# Altium project BMS_rev3.PrjPCB (part 3 of 3)

## Sheet BMS_SERIAL.SchDoc
size B; Organization: Altium Limited; Address1: L3, 12a Rodborough Rd; Address2: Frenchs Forest; Address3: NSW; Address4: Australia 2086
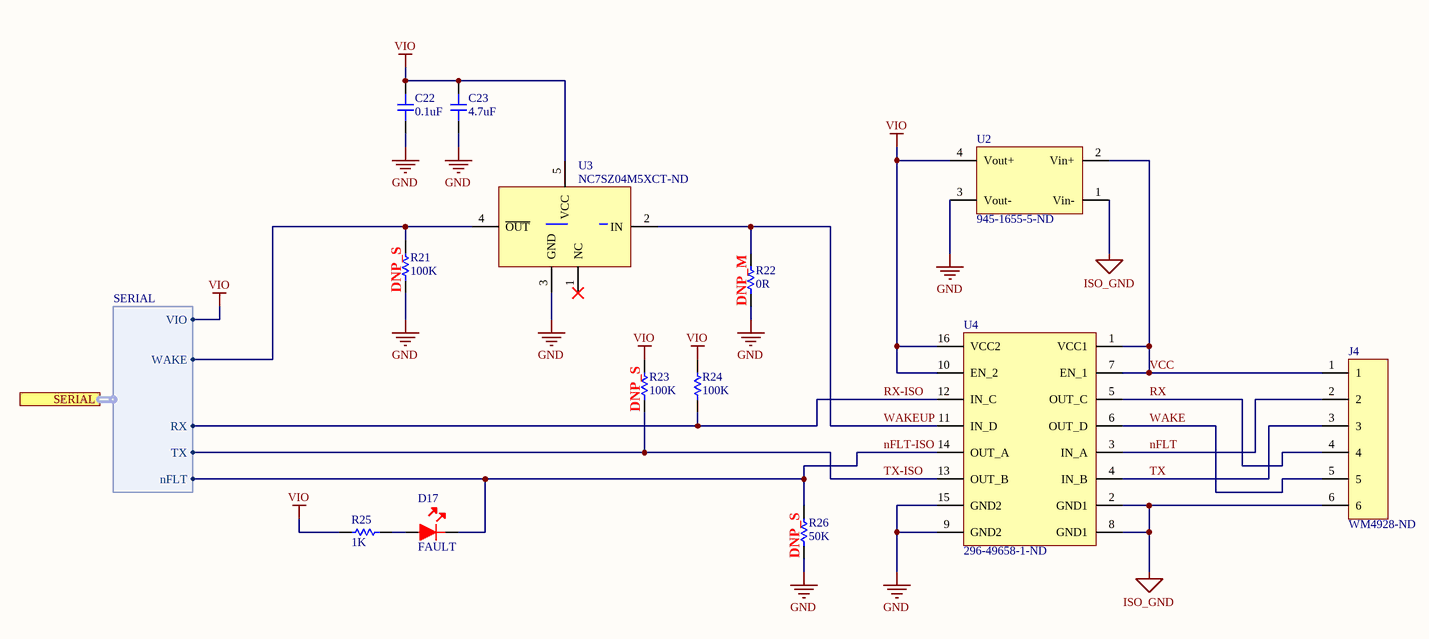
[diagram p6: BMS_SERIAL.SchDoc]

### Parts
C22  0.1uF  [CAP-0805]
C23  4.7uF  [CAP-0805]
D17  FAULT  [LED-0603]
J4  WM4928-ND  [6PIN]
R21  100K  [RES-0603]
R22  0R  [RES-0603]
R23  100K  [RES-0603]
R24  100K  [RES-0603]
R25  1K  [RES-0603]
R26  50K  [RES-0603]
U2  945-1655-5-ND  [ROE5050]
U3  NC7SZ04M5XCT-ND  [SOT-23-5]
U4  296-49658-1-ND  [16-SSOP]

### Ports
SERIAL (harness SERIAL)

### Harnesses
SERIAL: WAKE, VIO, nFLT, RX, TX

### Nets
GND: C22.1 C23.1 R21.1 R22.1 R26.1 U2.3(Vout-) U3.3(GND) U4.9(GND2) U4.15(GND2)  [project net CELL0]
ISO_GND: J4.6 U2.1(Vin-) U4.2(GND1) U4.8(GND1)
VIO: C22.2 C23.2 R23.2 R24.2 R25.2 U2.4(Vout+) U3.5(VCC) U4.10(EN_2) U4.16(VCC2) ; port SERIAL.VIO
nFLT: J4.2 U4.3(IN_A)
nFLT-ISO: D17.2 R26.2 U4.14(OUT_A) ; port SERIAL.nFLT
RX: J4.4 U4.5(OUT_C)
RX-ISO: R24.1 U4.12(IN_C) ; port SERIAL.RX
TX: J4.3 U4.4(IN_B)
TX-ISO: R23.1 U4.13(OUT_B) ; port SERIAL.TX
VCC: J4.1 U2.2(Vin+) U4.1(VCC1) U4.7(EN_1)
WAKE: J4.5 U4.6(OUT_D)
WAKE-ISO: R21.2 U3.4(~{OUT}) ; port SERIAL.WAKE
WAKEUP: R22.2 U3.2(IN) U4.11(IN_D)
NetD17_1: D17.1 R25.1

Not connected (* = marked no-connect by the designer): U3 1(NC)*

### Notes on the sheet
- (near R21) DNP_S
- (near R22) DNP_M
- (near R23) DNP_S
- (near R26) DNP_S
- Title
- Size:
- Date:
- Tabloid
- Number:
- Time:
- Revision:
- Sheet
- of
- File:

### Library data of the parts
C22 = 0805-0.1uF-50V: CAP CER 0.1UF 50V Y5V 0805; Manufacturer: KEMET; Manufacturer Part Number: C0805C104Z5VACTU; Dielectric Material: Ceramic; Capacitance: 100nF; Tolerance: 80%; Dissipation Factor: 5%; Supplier 1: Digi-Key; Stock 1: 929243; Pricing 1: 1=0.1, 10=0.057, 100=0.0254, 500=0.01818, 1000=0.01428 (USD); Mount: Surface Mount,PCB; Case/Package: 0805; Number of Pins: 2; Case Code (Metric): 2012; Case Code (Imperial): 0805; Min Operating Temperature: -30°C; Max Operating Temperature: 85°C; Package Quantity: 1; Voltage Rating: 50V; Packaging: Tape and Reel; Voltage Rating (DC): 50V; Dielectric: Y5V; Termination: SMD/SMT; Voltage: 50V; Length: 2mm; Height: 0.9mm; Lead Pitch: 0.75mm; Width: 0.049inch; Thickness: 0.039inch; Depth: 1.25mm; Radiation Hardening: No; REACH SVHC: No SVHC; Lead Free: Lead Free; ComponentLink1URL: http://www.alliedelec.com/m/d/9bfe7773041ffe9d406e68bc7b377fdd.pdf?src-supplier=Allied+Electronics; ComponentLink1Description: http://www.alliedelec.com/m/d/9bfe7773041ffe9d406e68bc7b377fdd.pdf?src-supplier=Allied+Electronics; ComponentLink2URL: https://www.verical.com/server-webapp/html/getDatasheet?partID=37101&src-supplier=Verical; ComponentLink2Description: https://www.verical.com/server-webapp/html/getDatasheet?partID=37101&src-supplier=Verical; ComponentLink3URL: https://www.verical.com/server-webapp/html/getDatasheet?partID=321176&src-supplier=Verical; ComponentLink3Description: https://www.verical.com/server-webapp/html/getDatasheet?partID=321176&src-supplier=Verical; ComponentLink4URL: http://www.farnell.com/datasheets/2123124.pdf?src-supplier=Element14; ComponentLink4Description: http://www.farnell.com/datasheets/2123124.pdf?src-supplier=Element14; Supplier Part Number 1: 399-1177-6-ND
C23 = 0805-4.7uF-16V: CAP CER 4.7UF 16V X5R 0805; Manufacturer: KEMET; Manufacturer Part Number: C0805C475K4PACTU; Dielectric Material: Ceramic; Tolerance: 10%; Supplier 1: Digi-Key; Stock 1: 96594; Pricing 1: 1=0.24, 10=0.168, 100=0.0951, 500=0.0671, 1000=0.05872 (USD); Mount: Surface Mount; Case/Package: 0805; Min Operating Temperature: -55°C; Max Operating Temperature: 85°C; Capacitance: 4.7uF; Packaging: Tape and Reel; Dielectric: X5R; Voltage: 16V; Termination: SMD/SMT; Voltage Rating (DC): 16V; Length: 2mm; Height: 1.25mm; Depth: 1.25mm; Radiation Hardening: No; Lead Free: Lead Free; ComponentLink1URL: http://capacitoredge.kemet.com/capedge2/DataSheet?pn=C0805C475K4PAC7800&src-supplier=Avnet+Europe; ComponentLink1Description: http://capacitoredge.kemet.com/capedge2/DataSheet?pn=C0805C475K4PAC7800&src-supplier=Avnet+Europe; ComponentLink2URL: https://www.verical.com/server-webapp/html/getDatasheet?partID=319476&src-supplier=Verical; ComponentLink2Description: https://www.verical.com/server-webapp/html/getDatasheet?partID=319476&src-supplier=Verical; Supplier Part Number 1: 399-8101-6-ND
D17 = LED-Red: LED RED CLEAR 0603 SMD; Manufacturer: Wurth Electronics; Manufacturer Part Number: 150060RS75000; Viewing Angle: 140°; Lens Style: Clear,Rectangular; Luminous Intensity: 250mcd; Forward Current: 30mA; Forward Voltage: 2V; Wavelength: 625nm; Test Current: 20mA; Supplier 1: Digi-Key; Stock 1: 18518; Pricing 1: 1=0.14, 50=0.133, 100=0.114, 500=0.099 (USD); Mount: Surface Mount; Case/Package: 0603; Color: Red; Case Code (Metric): 1608; Case Code (Imperial): 0603; Min Operating Temperature: -40°C; Max Operating Temperature: 85°C; Package Quantity: 1; Packaging: Cut Tape; Dominant Wavelength: 625nm; Length: 1.6mm; Height: 0.7mm; Width: 0.8mm; REACH SVHC: Unknown; ComponentLink1URL: https://katalog.we-online.de/led/datasheet/150060RS75000.pdf?src-supplier=Digi-Key; ComponentLink1Description: https://katalog.we-online.de/led/datasheet/150060RS75000.pdf?src-supplier=Digi-Key; ComponentLink2URL: http://www.produktinfo.conrad.com/datenblaetter/750000-774999/759428-da-01-en-CHIPLED_0603_W_KL_ROT_150060RS75000.pdf?src-supplier=Conrad; ComponentLink2Description: http://www.produktinfo.conrad.com/datenblaetter/750000-774999/759428-da-01-en-CHIPLED_0603_W_KL_ROT_150060RS75000.pdf?src-supplier=Conrad; Supplier Part Number 1: 732-4978-6-ND
J4 = 6PIN: CONN HEADER R/A 6POS 2.54MM; Manufacturer: Molex; Manufacturer Part Number: 70553-0040; Contact Resistance: 30mR; Number of Positions: 6; Current Rating: 3A; Voltage Rating: 250V; Gender: Male; Insulation Resistance: 1GR; Glow Wire Compliant: Non-compliant; Supplier 1: Digi-Key; Stock 1: 2212; Pricing 1: 1=1.58, 10=1.434, 100=1.2289, 500=1.0241, 1000=0.8778, 5000=0.77832, 10000=0.76076 (USD); Mount: Through Hole; Contact Material: Bronze,Copper Alloy,Brass; Contact Plating: Tin; Housing Color: Black; Color: Black; Housing Material: Thermoplastic; Material: Brass; Min Operating Temperature: -40°C; Max Operating Temperature: 105°C; Number of Rows: 1; Packaging: Rail/Tube; Termination: Solder; Number of Contacts: 6; Orientation: Right Angle; Package Quantity: 1200; Max Current Rating: 3A; Max Voltage Rating (AC): 250V; Voltage Rating (DC): 250V; Number of Circuits: 6; Length: 17.79mm; Height: 6.99mm; Pitch: 2.54mm; Depth: 13.59mm; Radiation Hardening: No; REACH SVHC: Unknown; ELV: Compliant; Lead Free: Lead Free; Flammability Rating: UL94 V-0; ComponentLink1URL: http://uk.rs-online.com/webdocs/13c4/0900766b813c4993.pdf?src-supplier=RSComponents; ComponentLink1Description: http://uk.rs-online.com/webdocs/13c4/0900766b813c4993.pdf?src-supplier=RSComponents; ComponentLink2URL: http://www.molex.com/webdocs/datasheets/pdf/en-us/0705530040_PCB_HEADERS.pdf?src-supplier=Avnet+Europe; ComponentLink2Description: http://www.molex.com/webdocs/datasheets/pdf/en-us/0705530040_PCB_HEADERS.pdf?src-supplier=Avnet+Europe; ComponentLink3URL: http://www.farnell.com/datasheets/1844551.pdf?src-supplier=Farnell; ComponentLink3Description: http://www.farnell.com/datasheets/1844551.pdf?src-supplier=Farnell; ComponentLink4URL: http://www.mouser.com/ds/2/276/0705530040_PCB_HEADERS-172948.pdf?src-supplier=Mouser; ComponentLink4Description: http://www.mouser.com/ds/2/276/0705530040_PCB_HEADERS-172948.pdf?src-supplier=Mouser; ComponentLink5URL: http://www.farnell.com/cad/655744.pdf?src-supplier=Element14; ComponentLink5Description: http://www.farnell.com/cad/655744.pdf?src-supplier=Element14; ComponentLink6URL: http://www.jameco.com/Jameco/Products/ProdDS/1302975.pdf?src-supplier=Jameco; ComponentLink6Description: http://www.jameco.com/Jameco/Products/ProdDS/1302975.pdf?src-supplier=Jameco; Supplier Part Number 1: WM4928-ND
R21 R23 R24 = 0603-100KR: RES 100K OHM 1% 1/10W 0603; Manufacturer: Stackpole Electronics; Manufacturer Part Number: RMCF0603FT100K; Resistance: 100kR; Power Rating: 100mW; Temperature Coefficient: 100ppm/°C; Working Voltage: 75V; Supplier 1: Digi-Key; Stock 1: 1428218; Pricing 1: 1=0.1, 10=0.016, 100=0.0065, 1000=0.00292, 2500=0.00253 (USD); Mount: Surface Mount; Case/Package: 0603; Case Code (Metric): 1608; Case Code (Imperial): 0603; Contact Plating: Tin,Matte; Min Operating Temperature: -55°C; Max Operating Temperature: 155°C; Packaging: Tape and Reel; Tolerance: 1%; Composition: Thick Film; Number of Terminations: 2; Military Standard: Not; Max Power Dissipation: 100mW; Features: Automotive AEC-Q200; Length: 1.55mm; Height: 0.022inch; Width: 0.031inch; Depth: 0.8mm; Radiation Hardening: No; Lead Free: Lead Free; ComponentLink1URL: https://www.verical.com/server-webapp/html/getDatasheet?partID=362597&src-supplier=Verical; ComponentLink1Description: https://www.verical.com/server-webapp/html/getDatasheet?partID=362597&src-supplier=Verical; Supplier Part Number 1: RMCF0603FT100KDKR-ND
R22 = 0603-0R: RES SMD 0 OHM JUMPER 1/10W 0603; Manufacturer: Yageo; Manufacturer Part Number: RC0603JR-070RL; Resistance: 0mR; Tolerance: 1%; Voltage Rating: 50V; Power Rating: 100mW; Temperature Coefficient: 200ppm/°C; Supplier 1: Digi-Key; Stock 1: 25658294; Pricing 1: 1=0.1, 10=0.019, 25=0.0136, 50=0.0104, 100=0.0077, 250=0.00588, 500=0.00472, 1000=0.00347 (USD); Case/Package: 0603; Number of Pins: 2; Case Code (Imperial): 0603; Case Code (Metric): 1608; Contact Plating: Tin,Matte; Min Operating Temperature: -55°C; Max Operating Temperature: 155°C; Package Quantity: 5000; Packaging: Tape and Reel; Voltage Rating (DC): 50V; Termination: SMD/SMT; Composition: Thick Film; Military Standard: Not; Length: 1.6mm; Height: 0.45mm; Width: 0.8mm; Depth: 0.8mm; Radiation Hardening: No; REACH SVHC: No SVHC; Lead Free: Lead Free; ComponentLink1URL: http://www.farnell.com/datasheets/2167052.pdf?src-supplier=Element14; ComponentLink1Description: http://www.farnell.com/datasheets/2167052.pdf?src-supplier=Element14; ComponentLink2URL: https://www.verical.com/server-webapp/html/getDatasheet?partID=329462&src-supplier=Verical; ComponentLink2Description: https://www.verical.com/server-webapp/html/getDatasheet?partID=329462&src-supplier=Verical; ComponentLink3URL: http://www.yageo.com/documents/recent/PYu-RC_Group_51_RoHS_L_9.pdf?src-supplier=Mouser; ComponentLink3Description: http://www.yageo.com/documents/recent/PYu-RC_Group_51_RoHS_L_9.pdf?src-supplier=Mouser; ComponentLink4URL: http://www.farnell.com/datasheets/443971.pdf?src-supplier=Element14; ComponentLink4Description: http://www.farnell.com/datasheets/443971.pdf?src-supplier=Element14; ComponentLink5URL: http://documents.rs-components.com/techlib://itc_doclist_GB.htm?stockno=6515918&src-supplier=RSComponents; ComponentLink5Description: http://documents.rs-components.com/techlib://itc_doclist_GB.htm?stockno=6515918&src-supplier=RSComponents; Supplier Part Number 1: 311-0.0GRCT-ND
R25 = 0603-1KR: RES SMD 1K OHM 1% 1/10W 0603; Manufacturer: Vishay Dale; Manufacturer Part Number: CRCW06031K00FKEA; Resistance: 1kR; Power Rating: 100mW; Voltage Rating: 75V; Temperature Coefficient: 100ppm/°C; Supplier 1: Digi-Key; Stock 1: 671453; Pricing 1: 1=0.1, 10=0.034, 100=0.0139, 1000=0.00623, 2500=0.0054 (USD); Mount: Surface Mount; Case/Package: 0603; Number of Pins: 2; Weight: 7.1E-05oz; Case Code (Metric): 1608; Case Code (Imperial): 0603; Contact Plating: Tin; Min Operating Temperature: -55°C; Max Operating Temperature: 155°C; Composition: Thick Film; Tolerance: 1%; Packaging: Tape and Reel; Package Quantity: 10; Number of Terminations: 2; Termination: SMD/SMT; Military Standard: Not; Max Power Dissipation: 100mW; Voltage Rating (DC): 75V; Features: Automotive AEC-Q200; Length: 1.55mm; Height: 0.45mm; Width: 0.033inch; Depth: 0.85mm; Radiation Hardening: No; REACH SVHC: Unknown; Lead Free: Lead Free; ComponentLink1URL: http://www.vishay.com/docs/20035/dcrcwe3.pdf?src-supplier=Digi-Key; ComponentLink1Description: http://www.vishay.com/docs/20035/dcrcwe3.pdf?src-supplier=Digi-Key; ComponentLink2URL: http://uk.rs-online.com/webdocs/0d98/0900766b80d98afc.pdf?src-supplier=RSComponents; ComponentLink2Description: http://uk.rs-online.com/webdocs/0d98/0900766b80d98afc.pdf?src-supplier=RSComponents; ComponentLink3URL: http://www.vishay.com/docs/20035/dcrcwe3.pdf?src-supplier=Avnet; ComponentLink3Description: http://www.vishay.com/docs/20035/dcrcwe3.pdf?src-supplier=Avnet; ComponentLink4URL: http://www.vishay.com/docs/20035/dcrcwe3.pdf?src-supplier=Avnet+Asia; ComponentLink4Description: http://www.vishay.com/docs/20035/dcrcwe3.pdf?src-supplier=Avnet+Asia; ComponentLink5URL: http://www.farnell.com/datasheets/2310790.pdf?src-supplier=Element14; ComponentLink5Description: http://www.farnell.com/datasheets/2310790.pdf?src-supplier=Element14; ComponentLink6URL: https://www.distrelec.biz/Web/Downloads/a_/en/flD-CRCW-e3_data_en.pdf?mime=application%2Fpdf&src-supplier=Distrelec; ComponentLink6Description: https://www.distrelec.biz/Web/Downloads/a_/en/flD-CRCW-e3_data_en.pdf?mime=application%2Fpdf&src-supplier=Distrelec; ComponentLink7URL: http://www.vishay.com/docs/20035/dcrcwe3.pdf?src-supplier=Future+Electronics; ComponentLink7Description: http://www.vishay.com/docs/20035/dcrcwe3.pdf?src-supplier=Future+Electronics; ComponentLink8URL: http://www.vishay.com/docs/20035/dcrcwe3.pdf?src-supplier=Avnet+Europe; ComponentLink8Description: http://www.vishay.com/docs/20035/dcrcwe3.pdf?src-supplier=Avnet+Europe; Supplier Part Number 1: 541-1.00KHCT-ND
R26 = 0603-50KR: RES SMD 49.9K OHM 1% 1/10W 0603; Manufacturer: Yageo; Manufacturer Part Number: RC0603FR-0749K9L; Power Rating: 100mW; Resistance: 49.9kR; Temperature Coefficient: 100ppm/°C; Voltage Rating (DC): 50V; Supplier 1: Digi-Key; Stock 1: 1201103; Pricing 1: 1=0.1, 10=0.023, 100=0.0094, 1000=0.00421, 2500=0.00366 (USD); Mount: Surface Mount; Case/Package: 0603; Case Code (Metric): 1608; Case Code (Imperial): 0603; Min Operating Temperature: -55°C; Max Operating Temperature: 155°C; Tolerance: 1%; Packaging: Tape and Reel; Package Quantity: 1; Voltage Rating: 50V; Composition: Thick Film; Number of Terminations: 2; Termination: SMD/SMT; Military Standard: Not; Max Power Dissipation: 100mW; Features: Moisture Resistant; Length: 0.063inch; Height: 0.022inch; Width: 0.031inch; Depth: 0.8mm; Lead Free: Lead Free; ComponentLink1URL: https://www.verical.com/server-webapp/html/getDatasheet?partID=323805&src-supplier=Verical; ComponentLink1Description: https://www.verical.com/server-webapp/html/getDatasheet?partID=323805&src-supplier=Verical; ComponentLink2URL: http://www.yageo.com/documents/recent/PYu-RC_Group_51_RoHS_L_10.pdf?src-supplier=Digi-Key; ComponentLink2Description: http://www.yageo.com/documents/recent/PYu-RC_Group_51_RoHS_L_10.pdf?src-supplier=Digi-Key; ComponentLink3URL: http://www.yageo.com/documents/recent/PYu-RC_Group_51_RoHS_L_9.pdf?src-supplier=Digi-Key; ComponentLink3Description: http://www.yageo.com/documents/recent/PYu-RC_Group_51_RoHS_L_9.pdf?src-supplier=Digi-Key; Supplier Part Number 1: 311-49.9KHRDKR-ND
U2 = DCDC5V-5V: DC DC CONVERTER 5V 1W; Manufacturer: Recom; Manufacturer Part Number: ROE-0505S; Min Input Voltage: 4.5V; Max Input Voltage: 5.5V; Number of Outputs: 1; Max Output Current: 200mA; Efficiency: 75%; Isolation Voltage: 1kV; Isolation: Isolated; Supplier 1: Digi-Key; Stock 1: 4706; Pricing 1: 1=2.64, 5=2.604, 10=2.567, 25=2.4916, 50=2.416, 100=2.3405, 250=2.265, 500=2.114 (USD); Mount: Through Hole; Case/Package: SIP; Number of Pins: 4; Weight: 1.4g; Min Operating Temperature: -40°C; Max Operating Temperature: 85°C; Nominal Output Voltage: 5V; Output Current: 200mA; Output Voltage: 5V; Power Rating: 1W; Nominal Input Voltage: 5V; Output Power: 1W; Package Quantity: 42; Packaging: Rail/Tube; Min Input Voltage (DC): 4.5V; Voltage - Output 1: 5V; Current - Output 1: 200mA; Max Input Voltage (DC): 5.5V; Max Output Power: 1W; Max Power Dissipation: 1W; Max Output Voltage: 5V; Length: 11.5mm; Height: 10mm; Width: 6mm; Depth: 6mm; REACH SVHC: No SVHC; Lead Free: Lead Free; ComponentLink1URL: http://www.farnell.com/datasheets/2787770.pdf?src-supplier=Element14; ComponentLink1Description: http://www.farnell.com/datasheets/2787770.pdf?src-supplier=Element14; ComponentLink2URL: http://www.mouser.com/ds/2/468/ROE-766139.pdf?src-supplier=Mouser; ComponentLink2Description: http://www.mouser.com/ds/2/468/ROE-766139.pdf?src-supplier=Mouser; ComponentLink3URL: https://www.recom-power.com/pdf/Econoline/ROE.pdf?src-supplier=Digi-Key; ComponentLink3Description: https://www.recom-power.com/pdf/Econoline/ROE.pdf?src-supplier=Digi-Key; ComponentLink4URL: http://www.recom-international.com/pdf/Econoline/ROE.pdf?src-supplier=Future+Electronics; ComponentLink4Description: http://www.recom-international.com/pdf/Econoline/ROE.pdf?src-supplier=Future+Electronics; ComponentLink5URL: http://uk.rs-online.com/webdocs/1373/0900766b81373201.pdf?src-supplier=RSComponents; ComponentLink5Description: http://uk.rs-online.com/webdocs/1373/0900766b81373201.pdf?src-supplier=RSComponents; ComponentLink6URL: http://www.produktinfo.conrad.com/datenblaetter/675000-699999/676228-da-01-en-DC_DC_WANDLER_ROE_0505S.pdf?src-supplier=Conrad; ComponentLink6Description: http://www.produktinfo.conrad.com/datenblaetter/675000-699999/676228-da-01-en-DC_DC_WANDLER_ROE_0505S.pdf?src-supplier=Conrad; Supplier Part Number 1: 945-1655-5-ND
U3 = Invert-NC7SZ04M5X: IC INVERTER 1CH 1-INP SOT23-5; Manufacturer: ON Semiconductor / Fairchild; Propagation Delay: 12ns; Max Supply Voltage: 5.5V; Min Supply Voltage: 1.65V; Number of Inputs: 1; Output Current: 32mA; Logic Function: Buffer,Inverter; Quiescent Current: 2uA; High Level Output Current: -32mA; Supplier 1: Digi-Key; Manufacturer Part Number: NC7SZ04M5X; Stock 1: 104504; Pricing 1: 1=0.47, 10=0.348, 25=0.3044, 100=0.1971, 250=0.16312, 500=0.1305, 1000=0.10005 (USD); Mount: Surface Mount; Case/Package: SOT-23; Number of Pins: 5; Weight: 0.03g; Contact Plating: Tin,Matte; Min Operating Temperature: -40°C; Max Operating Temperature: 85°C; Packaging: Tape and Reel; Package Quantity: 1; Number of Elements: 1; Number of Circuits: 1; Low Level Output Current: 32mA; Turn-On Delay Time: 12ns; Radiation Hardening: No; REACH SVHC: No SVHC; Lead Free: Lead Free; ComponentLink1URL: http://www.jameco.com/Jameco/Products/ProdDS/1015511.pdf?src-supplier=Jameco; ComponentLink1Description: http://www.jameco.com/Jameco/Products/ProdDS/1015511.pdf?src-supplier=Jameco; ComponentLink2URL: https://www.fairchildsemi.com/datasheets/NC/NC7SZ04.pdf?src-supplier=Digi-Key; ComponentLink2Description: https://www.fairchildsemi.com/datasheets/NC/NC7SZ04.pdf?src-supplier=Digi-Key; ComponentLink3URL: http://www.farnell.com/datasheets/1639856.pdf?src-supplier=Element14; ComponentLink3Description: http://www.farnell.com/datasheets/1639856.pdf?src-supplier=Element14; ComponentLink4URL: http://www.fairchildsemi.com/ds/NC/NC7SZ04.pdf?src-supplier=Avnet+Europe; ComponentLink4Description: http://www.fairchildsemi.com/ds/NC/NC7SZ04.pdf?src-supplier=Avnet+Europe; ComponentLink5URL: https://www.verical.com/server-webapp/html/getDatasheet?partID=120911&src-supplier=Verical; ComponentLink5Description: https://www.verical.com/server-webapp/html/getDatasheet?partID=120911&src-supplier=Verical; ComponentLink6URL: https://www.fairchildsemi.com/datasheets/NC/NC7SZ04.pdf?src-supplier=Avnet; ComponentLink6Description: https://www.fairchildsemi.com/datasheets/NC/NC7SZ04.pdf?src-supplier=Avnet; ComponentLink7URL: http://www.fairchildsemi.com/ds/NC/NC7SZ04.pdf?src-supplier=Future+Electronics; ComponentLink7Description: http://www.fairchildsemi.com/ds/NC/NC7SZ04.pdf?src-supplier=Future+Electronics; Supplier Part Number 1: NC7SZ04M5XDKR-ND
U4 = 4channel-ISO: DGTL ISO 2500VRMS 4CH GP 16SSOP; Manufacturer: Texas Instruments; Manufacturer Part Number: ISO7742DBQR; Number of Channels: 4; Isolated Power: No; Channel Type: Unidirectional; Data Rate: 100Mbps; Propagation Delay: 16ns; Pulse Width Distortion (PWD): 4.9ns; Supplier 1: Digi-Key; Stock 1: 0; Pricing 1: 1=2.99, 10=2.689, 25=2.5424, 100=2.0905, 250=1.8758, 500=1.808, 1000=1.5029 (USD); Mount: Surface Mount; Case/Package: SSOP; Number of Pins: 16; Min Operating Temperature: -55°C; Max Operating Temperature: 125°C; Type: General Purpose; Packaging: Tape and Reel; ComponentLink1URL: http://www.ti.com/lit/ds/symlink/iso7742.pdf?src-supplier=Digi-Key; ComponentLink1Description: http://www.ti.com/lit/ds/symlink/iso7742.pdf?src-supplier=Digi-Key; Supplier Part Number 1: 296-49658-6-ND

## Nets that join several sheets
CELL0: BMS_BALANCE (J1.13 R10.2), U_BMS_BALANCE/8 (C24_8.1), U_BMS_BALANCE/7 (C24_7.1), U_BMS_BALANCE/6 (C24_6.1), U_BMS_BALANCE/5 (C24_5.1), U_BMS_BALANCE/4 (C24_4.1), U_BMS_BALANCE/3 (C24_3.1), U_BMS_BALANCE/2 (C24_2.1), U_BMS_BALANCE/1 (C24_1.1 Q2_1.3 R39_1.1), U_BMS_BALANCE/9 (C24_9.1), U_BMS_BALANCE/11 (C24_11.1), U_BMS_BALANCE/10 (C24_10.1), U_BMS_BALANCE/12 (C24_12.1), BMS_CPU (25 pins), BMS_DAISYCHAIN (9 pins), BMS_TEMP (8 pins), BMS_SERIAL (9 pins)
VAO: BMS_CPU (C11.2 U1.58), BMS_DAISYCHAIN (R17.2)
VIO: BMS_CPU (R1.2 U1.41), BMS_SERIAL (9 pins)
VP: BMS_CPU (6 pins), BMS_TEMP (8 pins)
CELL1: BMS_BALANCE (J1.12), U_BMS_BALANCE/2 (Q2_2.3 R39_2.1), U_BMS_BALANCE/1 (C24_1.2 R35_1.2 R36_1.2 R37_1.2)
CELL2: BMS_BALANCE (J1.11), U_BMS_BALANCE/3 (Q2_3.3 R39_3.1), U_BMS_BALANCE/2 (C24_2.2 R35_2.2 R36_2.2 R37_2.2)
CELL3: BMS_BALANCE (J1.10), U_BMS_BALANCE/4 (Q2_4.3 R39_4.1), U_BMS_BALANCE/3 (C24_3.2 R35_3.2 R36_3.2 R37_3.2)
CELL4: BMS_BALANCE (J1.9), U_BMS_BALANCE/5 (Q2_5.3 R39_5.1), U_BMS_BALANCE/4 (C24_4.2 R35_4.2 R36_4.2 R37_4.2)
CELL5: BMS_BALANCE (J1.8), U_BMS_BALANCE/6 (Q2_6.3 R39_6.1), U_BMS_BALANCE/5 (C24_5.2 R35_5.2 R36_5.2 R37_5.2)
CELL6: BMS_BALANCE (J1.7), U_BMS_BALANCE/7 (Q2_7.3 R39_7.1), U_BMS_BALANCE/6 (C24_6.2 R35_6.2 R36_6.2 R37_6.2)
CELL7: BMS_BALANCE (J1.6), U_BMS_BALANCE/8 (Q2_8.3 R39_8.1), U_BMS_BALANCE/7 (C24_7.2 R35_7.2 R36_7.2 R37_7.2)
CELL8: BMS_BALANCE (J1.5), U_BMS_BALANCE/8 (C24_8.2 R35_8.2 R36_8.2 R37_8.2), U_BMS_BALANCE/9 (Q2_9.3 R39_9.1)
CELL9: BMS_BALANCE (J1.4), U_BMS_BALANCE/9 (C24_9.2 R35_9.2 R36_9.2 R37_9.2), U_BMS_BALANCE/10 (Q2_10.3 R39_10.1)
CELL10: BMS_BALANCE (J1.3), U_BMS_BALANCE/11 (Q2_11.3 R39_11.1), U_BMS_BALANCE/10 (C24_10.2 R35_10.2 R36_10.2 R37_10.2)
CELL11: BMS_BALANCE (J1.2), U_BMS_BALANCE/11 (C24_11.2 R35_11.2 R36_11.2 R37_11.2), U_BMS_BALANCE/12 (Q2_12.3 R39_12.1)
CELL12: BMS_BALANCE (J1.1), U_BMS_BALANCE/12 (C24_12.2 R35_12.2 R36_12.2 R37_12.2), BMS_CPU (R5.1 R6.1)
COMH_N: BMS_CPU (U1.54), BMS_DAISYCHAIN (D12.1 R14.1)
COMH_P: BMS_CPU (U1.55), BMS_DAISYCHAIN (D11.1 R13.1)
COML_N: BMS_CPU (U1.53), BMS_DAISYCHAIN (D13.1 R15.1 R16.2)
COML_P: BMS_CPU (U1.52), BMS_DAISYCHAIN (D14.1 R17.1 R18.1)
EQ-1: U_BMS_BALANCE/1 (R38_1.1), BMS_CPU (U1.28)
EQ-2: U_BMS_BALANCE/2 (R38_2.1), BMS_CPU (U1.26)
EQ-3: U_BMS_BALANCE/3 (R38_3.1), BMS_CPU (U1.24)
EQ-4: U_BMS_BALANCE/4 (R38_4.1), BMS_CPU (U1.22)
EQ-5: U_BMS_BALANCE/5 (R38_5.1), BMS_CPU (U1.20)
EQ-6: U_BMS_BALANCE/6 (R38_6.1), BMS_CPU (U1.18)
EQ-7: U_BMS_BALANCE/7 (R38_7.1), BMS_CPU (U1.16)
EQ-8: U_BMS_BALANCE/8 (R38_8.1), BMS_CPU (U1.14)
EQ-9: U_BMS_BALANCE/9 (R38_9.1), BMS_CPU (U1.12)
EQ-10: U_BMS_BALANCE/10 (R38_10.1), BMS_CPU (U1.10)
EQ-11: U_BMS_BALANCE/11 (R38_11.1), BMS_CPU (U1.8)
EQ-12: U_BMS_BALANCE/12 (R38_12.1), BMS_CPU (U1.6)
FLTH_N: BMS_CPU (U1.56), BMS_DAISYCHAIN (D10.1 R12.1)
FLTH_P: BMS_CPU (U1.57), BMS_DAISYCHAIN (D9.1 R11.1)
FLTL_N: BMS_CPU (U1.51), BMS_DAISYCHAIN (D15.1 R19.1)
FLTL_P: BMS_CPU (U1.50), BMS_DAISYCHAIN (D16.1 R20.1)
nFLT-ISO: BMS_CPU (U1.40), BMS_SERIAL (D17.2 R26.2 U4.14)
RX-ISO: BMS_CPU (U1.39), BMS_SERIAL (R24.1 U4.12)
TEMP-0: BMS_CPU (U1.66), BMS_TEMP (J5.9 R34.2)
TEMP-1: BMS_CPU (U1.65), BMS_TEMP (J5.10 R33.2)
TEMP-2: BMS_CPU (U1.64), BMS_TEMP (J5.11 R32.2)
TEMP-3: BMS_CPU (U1.63), BMS_TEMP (J5.12 R31.2)
TEMP-4: BMS_CPU (U1.62), BMS_TEMP (J5.13 R30.2)
TEMP-5: BMS_CPU (U1.61), BMS_TEMP (J5.14 R29.2)
TEMP-6: BMS_CPU (U1.60), BMS_TEMP (J5.15 R28.2)
TEMP-7: BMS_CPU (U1.59), BMS_TEMP (J5.16 R27.2)
TX-ISO: BMS_CPU (U1.38), BMS_SERIAL (R23.1 U4.13)
VSNS0: BMS_BALANCE (R10.1), U_BMS_BALANCE/1 (D19_1.2), BMS_CPU (C12.2 D4.2 D5.1 U1.29)
VSNS1: U_BMS_BALANCE/2 (D19_2.2), U_BMS_BALANCE/1 (D19_1.1 R35_1.1), BMS_CPU (U1.27)
VSNS2: U_BMS_BALANCE/3 (D19_3.2), U_BMS_BALANCE/2 (D19_2.1 R35_2.1), BMS_CPU (U1.25)
VSNS3: U_BMS_BALANCE/4 (D19_4.2), U_BMS_BALANCE/3 (D19_3.1 R35_3.1), BMS_CPU (U1.23)
VSNS4: U_BMS_BALANCE/5 (D19_5.2), U_BMS_BALANCE/4 (D19_4.1 R35_4.1), BMS_CPU (U1.21)
VSNS5: U_BMS_BALANCE/6 (D19_6.2), U_BMS_BALANCE/5 (D19_5.1 R35_5.1), BMS_CPU (U1.19)
VSNS6: U_BMS_BALANCE/7 (D19_7.2), U_BMS_BALANCE/6 (D19_6.1 R35_6.1), BMS_CPU (U1.17)
VSNS7: U_BMS_BALANCE/8 (D19_8.2), U_BMS_BALANCE/7 (D19_7.1 R35_7.1), BMS_CPU (U1.15)
VSNS8: U_BMS_BALANCE/8 (D19_8.1 R35_8.1), U_BMS_BALANCE/9 (D19_9.2), BMS_CPU (U1.13)
VSNS9: U_BMS_BALANCE/9 (D19_9.1 R35_9.1), U_BMS_BALANCE/10 (D19_10.2), BMS_CPU (U1.11)
VSNS10: U_BMS_BALANCE/11 (D19_11.2), U_BMS_BALANCE/10 (D19_10.1 R35_10.1), BMS_CPU (U1.9)
VSNS11: U_BMS_BALANCE/11 (D19_11.1 R35_11.1), U_BMS_BALANCE/12 (D19_12.2), BMS_CPU (U1.7)
VSNS12: U_BMS_BALANCE/12 (D19_12.1 R35_12.1), BMS_CPU (D2.1 D3.2 U1.5)
WAKE-ISO: BMS_CPU (U1.49), BMS_SERIAL (R21.2 U3.4)